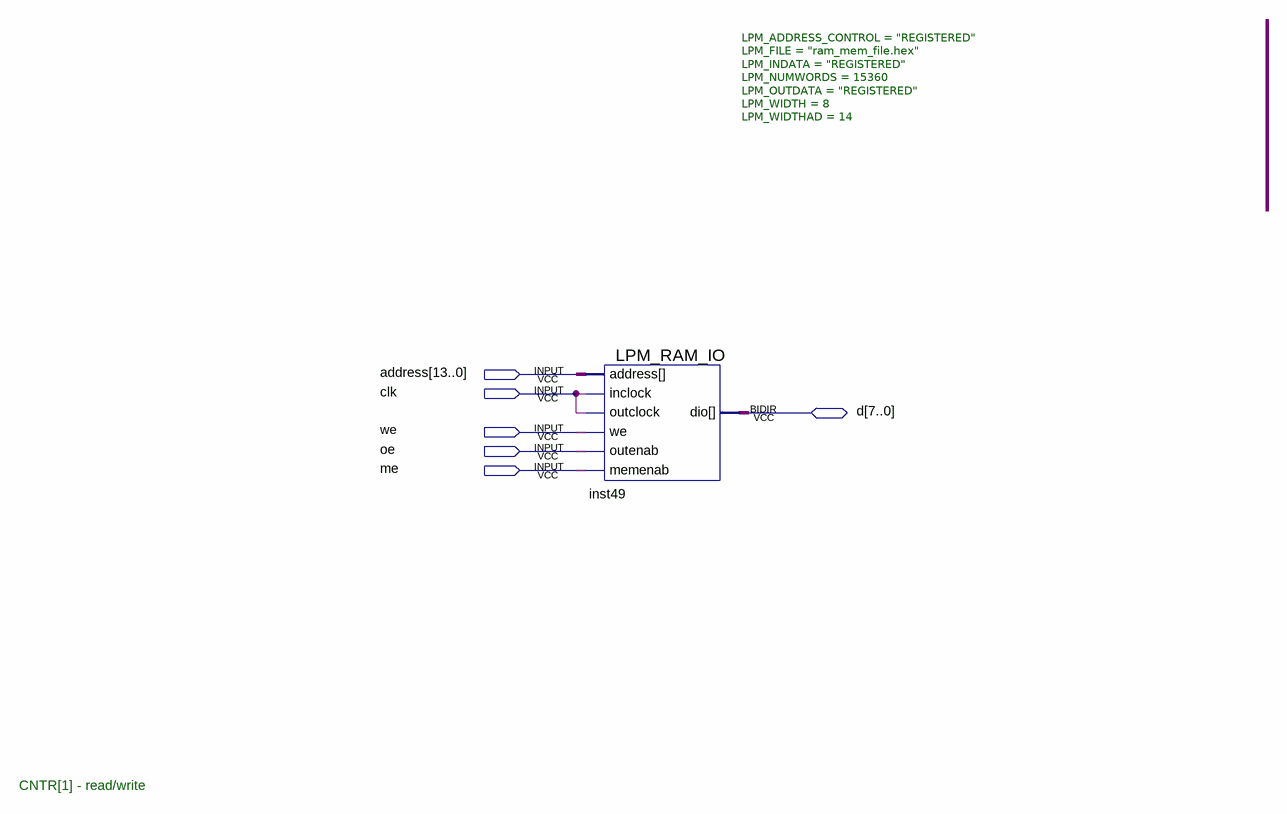
[diagram p0: schematic sheet]
// Quartus schematic __ctrl_test.bdf as structural Verilog: 1 symbols, 6 pins
module __ctrl_test (
  input  [13:0] address,
  input  clk,
  input  we,
  input  oe,
  input  me,
  inout  [7:0] d
);

  LPM_RAM_IO #(.LPM_ADDRESS_CONTROL("REGISTERED"), .LPM_FILE("ram_mem_file.hex"), .LPM_INDATA("REGISTERED"), .LPM_NUMWORDS(15360), .LPM_OUTDATA("REGISTERED"), .LPM_WIDTH(8), .LPM_WIDTHAD(14)) inst49 (
    .address(address), .outclock(clk), .memenab(me), .inclock(clk), .we(we), .outenab(oe), .dio(d));

  // Notes on the sheet:
  //   CNTR[1] - read/write
endmodule
